# Altium project ID_VD.PrjPcb
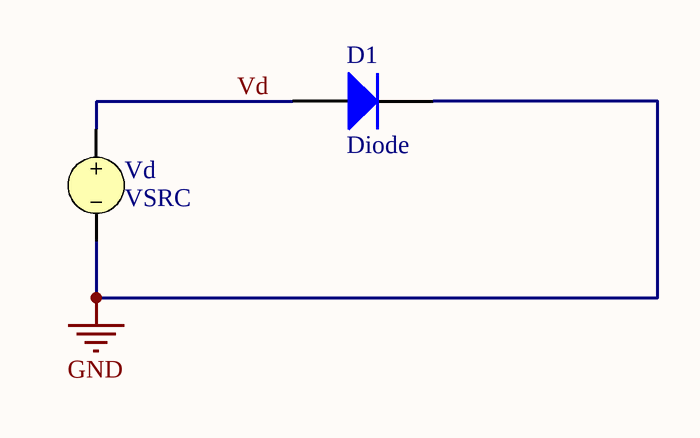
[diagram p0: ID_VD.SchDoc]
1 sheet, 2 parts. Net scope: global (net labels, ports and power ports of the same name join across sheets).

## Sheet ID_VD.SchDoc
size A4

### Parts
D1  Diode  [SMC]
Vd  VSRC

### Nets
GND: D1.2(K) Vd.2
Vd: D1.1(A) Vd.1

### Library data of the parts
D1 = Diode: Default Diode; Published: 8-Jun-2000; LatestRevisionDate: 17-Jul-2002; LatestRevisionNote: Re-released for DXP Platform.; PackageDocument: Sep-1996; PackageReference: SMC; Publisher: Altium Limited; Code_JEDEC: DO-214-AB
Vd = VSRC: Voltage Source; Note: PCB Footprint - Not required; Value: 500m; Published: 8-Jun-2000; LatestRevisionDate: 17-Jul-2002; LatestRevisionNote: Re-released for DXP Platform.; PackageReference: Not Applicable; Publisher: Altium Limited